# Altium project Full_Bridge_Converter.PrjPcb (part 1 of 2)
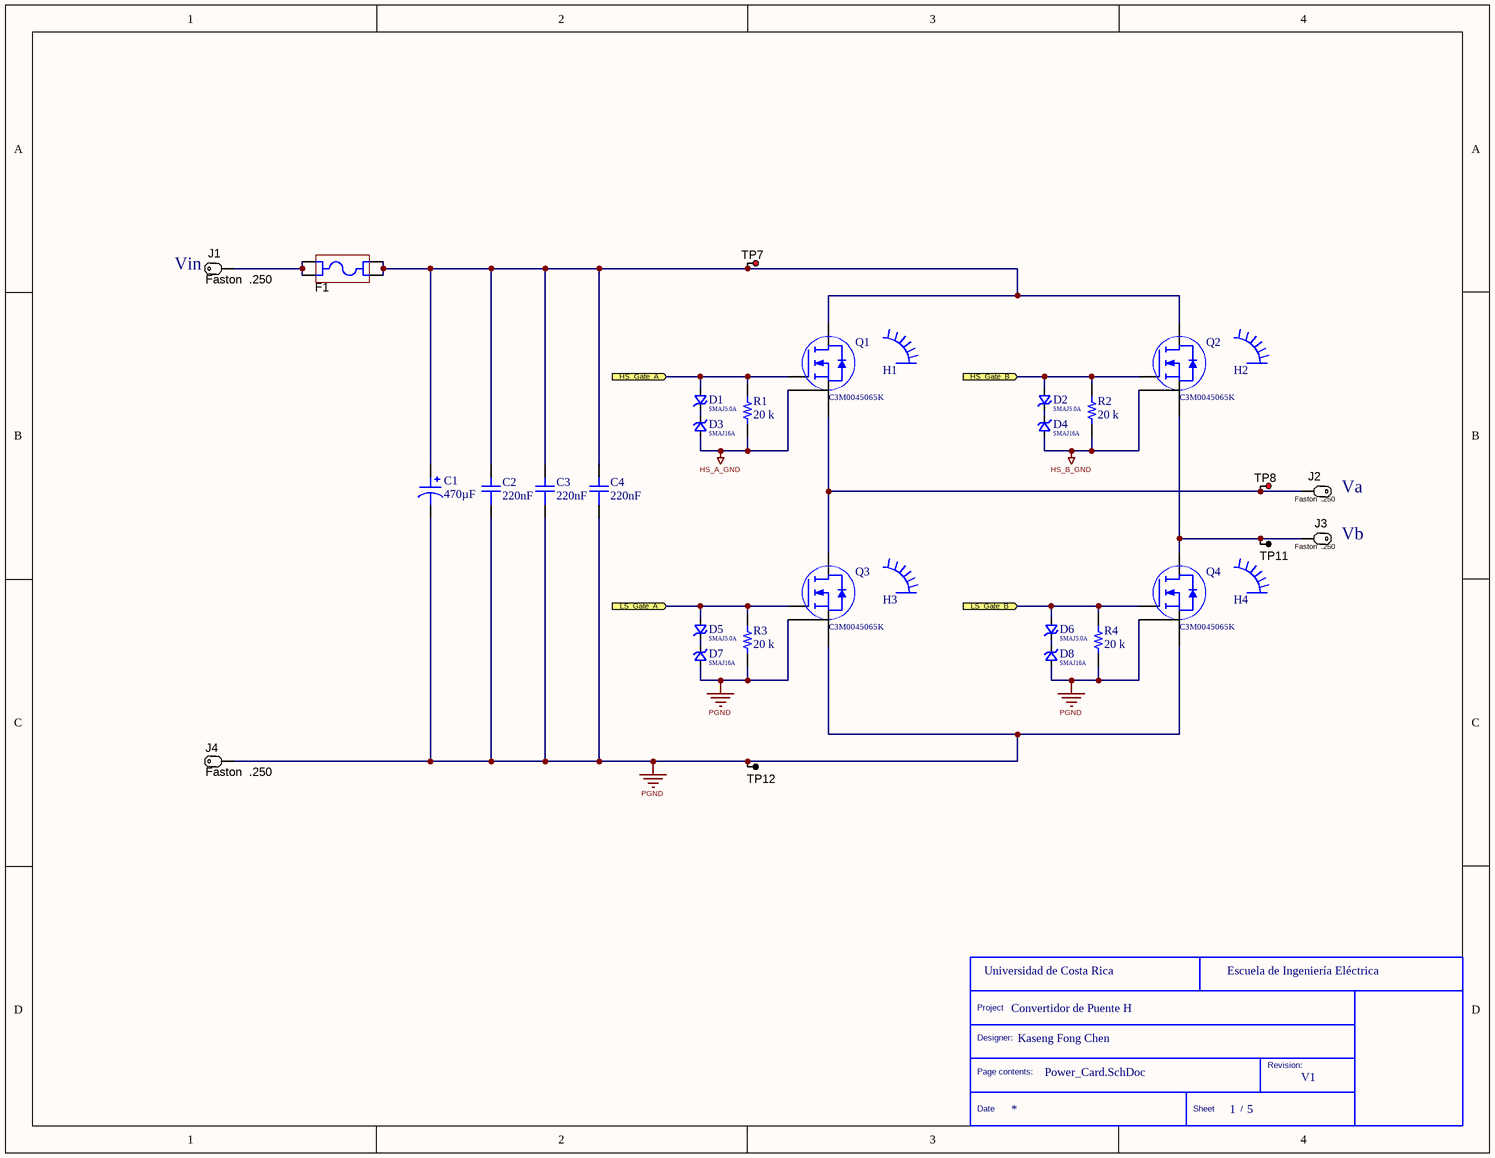
[diagram p0: Power_Card.SchDoc]
Company: Universidad de Costa Rica; Department: Escuela de Ingeniería Eléctrica; DesignByURL: Kaseng Fong Chen; Project: Convertidor de Puente H; VersionRevision: V1
5 sheets, 192 parts. Net scope: flat (ports and power ports of the same name join across sheets).
Board file: Full_Bridge_Converter.PcbDoc
Sheets:
  Power_Card.SchDoc
  Gate_Driver.SchDoc
  PowerSupply.SchDoc
  Optic_PWM.SchDoc
  Hardware.SchDoc

## Sheet Power_Card.SchDoc
size Letter; SheetNumber: 1; SheetTotal: 5

### Parts
(Parts that share a designator on the sheet are numbered #1, #2 ... from top to bottom, then left to right.)
*#1  TittleBlock  (value not drawn)  (graphical)
C1  470µF  [CAP TH ALUM ELEC D35.00mm S10.00mm H40.00mm]
C2  220nF  [R75PI32204030J]
C3  220nF  [R75PI32204030J]
C4  220nF  [R75PI32204030J]
D1  SMAJ5.0A  [DO214AC SMA]
D2  SMAJ5.0A  [DO214AC SMA]
D3  SMAJ16A  [DO214AC SMA]
D4  SMAJ16A  [DO214AC SMA]
D5  SMAJ5.0A  [DO214AC SMA]
D6  SMAJ5.0A  [DO214AC SMA]
D7  SMAJ16A  [DO214AC SMA]
D8  SMAJ16A  [DO214AC SMA]
F1  3101.0040  [SCHURTER_3101_0040]  (value not drawn)
H1  Disipador de 3.3.C/W  [HSINK_6399BG]  (value not drawn)
H2  Disipador de 3.3.C/W  [HSINK_6399BG]  (value not drawn)
H3  Disipador de 3.3.C/W  [HSINK_6399BG]  (value not drawn)
H4  Disipador de 3.3.C/W  [HSINK_6399BG]  (value not drawn)
J1  Faston  .250  [TE_62409-1]
J2  Faston  .250  [TE_62409-1]
J3  Faston  .250  [TE_62409-1]
J4  Faston  .250  [TE_62409-1]
Q1  C3M0045065K  [TO-247-4L_C3M0075120K_WFS]
Q2  C3M0045065K  [TO-247-4L_C3M0075120K_WFS]
Q3  C3M0045065K  [TO-247-4L_C3M0075120K_WFS]
Q4  C3M0045065K  [TO-247-4L_C3M0075120K_WFS]
R1  20 k  [RES 0603_1608]
R2  20 k  [RES 0603_1608]
R3  20 k  [RES 0603_1608]
R4  20 k  [RES 0603_1608]
TP7  5010  [Keystone5010]  (value not drawn)
TP8  5010  [Keystone5010]  (value not drawn)
TP11  5011  [Keystone5011]  (value not drawn)
TP12  5011  [Keystone5011]  (value not drawn)

### Ports
HS_Gate_A (in), HS_Gate_B (in), LS_Gate_A (in), LS_Gate_B (in)

### Nets
HS_A_GND: D3.2 Q1.3(S) R1.1
HS_B_GND: D4.2 Q2.3(S) R2.1
PGND: C1.2 C2.2 C3.2 C4.2 D7.2 D8.2 J4.1(P1) Q3.2(Power_Source) Q3.3(S) Q4.2(Power_Source) Q4.3(S) R3.1 R4.1 TP12.1
NetC1_1: C1.1 C2.1 C3.1 C4.1 F1.3 F1.4 Q1.1(D) Q2.1(D) TP7.1
NetD1_1: D1.1 D3.1
NetD1_2: D1.2 Q1.4(G) R1.2 ; port HS_Gate_A
NetD2_1: D2.1 D4.1
NetD2_2: D2.2 Q2.4(G) R2.2 ; port HS_Gate_B
NetD5_1: D5.1 D7.1
NetD5_2: D5.2 Q3.4(G) R3.2 ; port LS_Gate_A
NetD6_1: D6.1 D8.1
NetD6_2: D6.2 Q4.4(G) R4.2 ; port LS_Gate_B
NetF1_1: F1.1 F1.2 J1.1(P1)
NetJ2_1: J2.1(P1) Q1.2(Power_Source) Q3.1(D) TP8.1
NetJ3_1: J3.1(P1) Q2.2(Power_Source) Q4.1(D) TP11.1

### Notes on the sheet
- (near J1) Vin
- (near J2) Va
- Vb
- (in symbol TittleBlock) Project; Designer:; Page contents:; Revision:; Date; Sheet; /

### Library data of the parts
*#1 = TittleBlock: Standard Title block
C1 = ESMQ451VSN471MA40S: CAP ALUM 470UF 20% 450V SNAP; Manufacturer: United Chemi-Con; Lifetime @ Temp.: 2000 Hrs @ 85°C; Polarization: Polar; Ripple Current @ High Frequency: 3.618A @ 50kHz; Ripple Current @ Low Frequency: 2.53A @ 120Hz; Part Number: ESMQ451VSN471MA40S; Applications: General Purpose; Capacitance: 470µF; ComponentLink1Description: Datasheet; ComponentLink1URL: http://www.chemi-con.co.jp/cgi-bin/CAT_DB/SEARCH/cat_db_al.cgi?e=e&j=p&pdfname=smqlug; ComponentLink2Description: DigiKey Link; ComponentLink2URL: http://digikey.com/product-detail/en/united-chemi-con/ESMQ451VSN471MA40S/565-2798-ND/758010; Device Package: Radial, Can - Snap-In; Height - Seated (Max): 1.575" (40.00mm); LastUpdated: 13/9/2020 09:22:08; Lead Spacing: 0.394" (10.00mm); Lifecycle Status: Active; Minimum Order: 1; Mounting Type: Through Hole; Operating Temperature: -25°C ~ 85°C; Package / Case: Radial, Can - Snap-In; Packaging: Bulk; PartId: 26446; Part Status: Active; Price: 5.99; Series: SMQ; Size / Dimension: 1.378" Dia (35.00mm); Supplier 1: DigiKey; Supplier Part Number 1: 565-2798-ND; Tolerance: ±20%; Value: 470µF; Voltage - Rated: 450V
C2-C4 = R75PI32204030J: KEMET         R75PI32204030J            Film Capacitor, AEC-Q200 R75 Series, 0.22 F,  5%, PP (Polypropylene), 630 V; Voltage Rating: 630V; Voltage Rating (AC): 250V; Dissipation Factor: 0.05%; Lead Diameter: 0.8mm; Lead Length: 30mm; Supplier 1: Digi-Key; Supplier Part Number 1: 399-12761-ND; Manufacturer: KEMET; Manufacturer Part Number: R75PI32204030J; RoHS: Yes; Category: Film Capacitors; Stock 1: 488; Pricing 1: 1=0,95000, 10=0,72000, 50=0,59800, 100=0,51490, 500=0,39860, 1000=0,34324, 2500=0,32110, 5000=0,31002 (USD); Mount: Through Hole; Case/Package: Radial; Dielectric Material: PP; Min Operating Temperature: -55°C; Max Operating Temperature: 105°C; Capacitance: 220nF; Tolerance: 5%; Packaging: Bulk; Voltage Rating (DC): 630V; Dielectric: PP; Termination: PC Pins; Voltage: 630V; Length: 0.709inch; Width: 0.394inch; Height: 16mm; Height - Seated (Max): 0.634inch; Lead Pitch: 15mm; Depth: 10mm; REACH SVHC: No SVHC; RoHS Compliant: Yes; ComponentLink1URL: http://www.alliedelec.com/m/d/0659d349de7ca29105b1b70da899f791.pdf?src-supplier=Allied+Electronics; ComponentLink1Description: http://www.alliedelec.com/m/d/0659d349de7ca29105b1b70da899f791.pdf?src-supplier=Allied+Electronics; ComponentLink2URL: http://www.farnell.com/datasheets/2120989.pdf?src-supplier=Farnell; ComponentLink2Description: http://www.farnell.com/datasheets/2120989.pdf?src-supplier=Farnell; ComponentLink3URL: http://www.kemet.com/docfinder?Partnumber=R75PI32204030J&src-supplier=Digi-Key; ComponentLink3Description: http://www.kemet.com/docfinder?Partnumber=R75PI32204030J&src-supplier=Digi-Key; ComponentLink4URL: http://www.farnell.com/datasheets/2068064.pdf?src-supplier=Element14; ComponentLink4Description: http://www.farnell.com/datasheets/2068064.pdf?src-supplier=Element14
D1 D2 D5 D6 = SMAJ5.0A: BOURNS - SMAJ5.0A - TVS Diode, SMAJ Series, Unidirectional, 5 V, 9.2 V, DO-214AC (SMA), 2 Pins; Max Power Dissipation: 400W; Number of Elements: 1; Max Surge Current: 40A; Reverse Breakdown Voltage: 6.4V; Breakdown Voltage: 7V; Reverse Standoff Voltage: 5V; Clamping Voltage: 9.2V; Test Current: 10mA; Peak Pulse Current: 43.5A; Element Configuration: Single; Leakage Current: 800uA; Operating Supply Voltage: 3.5V; Power Line Protection: No; Diode Type: ZENER; ESD Protection: Yes; Supplier 1: Digi-Key; Supplier Part Number 1: SMAJ5.0ABCT-ND; Manufacturer: Bourns; Manufacturer Part Number: SMAJ5.0A; RoHS: Yes; Category: TVS Diodes; Stock 1: 30981; Pricing 1: 1=0,49000, 10=0,34300, 100=0,17320, 500=0,14130, 1000=0,10483, 2000=0,08820 (USD); Mount: Surface Mount; Case/Package: DO-214AC; Number of Pins: 2; Min Operating Temperature: -55°C; Max Operating Temperature: 150°C; Packaging: Tape and Reel; Package Quantity: 1; Series: SMAJ; Polarity: Unidirectional; Direction: Unidirectional; Peak Pulse Power: 400W; Min Breakdown Voltage: 6.4V; Number of Channels: 1; Max Reverse Leakage Current: 800uA; Termination: SMD/SMT; Max Breakdown Voltage: 7V; Number of Unidirectional Channels: 1; Resistor Type: Zener; Length: 4.57mm; Width: 2.92mm; Height: 2.42mm; Radiation Hardening: No; RoHS Compliant: Yes; REACH SVHC: No SVHC; ComponentLink1URL: https://datasheet.ciiva.com/25624/0900766b8112213b-25624680.pdf?src-supplier=RSComponents; ComponentLink1Description: https://datasheet.ciiva.com/25624/0900766b8112213b-25624680.pdf?src-supplier=RSComponents; ComponentLink2URL: https://datasheet.ciiva.com/333/smaj-333521.pdf?src-supplier=Digi-Key; ComponentLink2Description: https://datasheet.ciiva.com/333/smaj-333521.pdf?src-supplier=Digi-Key; ComponentLink3URL: https://datasheet.ciiva.com/333/smaj-333522.pdf?src-supplier=Digi-Key; ComponentLink3Description: https://datasheet.ciiva.com/333/smaj-333522.pdf?src-supplier=Digi-Key; ComponentLink4URL: https://datasheet.ciiva.com/333/smaj-333523.pdf?src-supplier=Digi-Key; ComponentLink4Description: https://datasheet.ciiva.com/333/smaj-333523.pdf?src-supplier=Digi-Key; ComponentLink5URL: https://datasheet.ciiva.com/3021/smaj-3021400.pdf?src-supplier=Avnet; ComponentLink5Description: https://datasheet.ciiva.com/3021/smaj-3021400.pdf?src-supplier=Avnet; ComponentLink6URL: https://datasheet.ciiva.com/30169/smaj-30169929.pdf?src-supplier=Onlinecomponents.com; ComponentLink6Description: https://datasheet.ciiva.com/30169/smaj-30169929.pdf?src-supplier=Onlinecomponents.com; ComponentLink7URL: https://datasheet.ciiva.com/28409/1695388-28409916.pdf?src-supplier=Element14; ComponentLink7Description: https://datasheet.ciiva.com/28409/1695388-28409916.pdf?src-supplier=Element14
D3 D4 D7 D8 = SMAJ16A: TVS DIODE 16VWM 26VC DO214AC; Manufacturer: Bourns; Clamping Voltage: 26V; Peak Pulse Power: 400W; Reverse Standoff Voltage: 16V; Peak Pulse Current: 15.3A; Polarity: Unidirectional; Test Current: 1mA; Min Breakdown Voltage: 17.8V; Max Surge Current: 40A; Breakdown Voltage: 19.7V; Operating Supply Voltage: 3.5V; Number of Channels: 1; Leakage Current: 5uA; Element Configuration: Single; Power Line Protection: No; Diode Type: ZENER; Supplier 1: Digi-Key; Supplier Part Number 1: SMAJ16ABCT-ND; Manufacturer Part Number: SMAJ16A; RoHS: Yes; Category: TVS Diodes; Stock 1: 14121; Pricing 1: 1=0,49000, 10=0,34400, 100=0,17360, 500=0,14160, 1000=0,10505, 2000=0,08838 (USD); Mount: Surface Mount; Case/Package: DO-214AC; Number of Pins: 2; Min Operating Temperature: -55°C; Max Operating Temperature: 150°C; Packaging: Tape and Reel; Package Quantity: 1; Direction: Unidirectional; Reverse Breakdown Voltage: 17.8V; Number of Elements: 1; Termination: SMD/SMT; Max Reverse Leakage Current: 5uA; Number of Unidirectional Channels: 1; Series: SMAJ; Max Power Dissipation: 400W; Resistor Type: Zener; Max Breakdown Voltage: 19.7V; Radiation Hardening: No; RoHS Compliant: Yes; REACH SVHC: No SVHC; ComponentLink1URL: https://datasheet.ciiva.com/3022/smaj-3022194.pdf?src-supplier=Avnet; ComponentLink1Description: https://datasheet.ciiva.com/3022/smaj-3022194.pdf?src-supplier=Avnet; ComponentLink2URL: https://datasheet.ciiva.com/3022/smaj-3022195.pdf?src-supplier=Avnet; ComponentLink2Description: https://datasheet.ciiva.com/3022/smaj-3022195.pdf?src-supplier=Avnet; ComponentLink3URL: https://datasheet.ciiva.com/8031/1695388-8031131.pdf?src-supplier=Element14; ComponentLink3Description: https://datasheet.ciiva.com/8031/1695388-8031131.pdf?src-supplier=Element14; ComponentLink4URL: https://datasheet.ciiva.com/28649/1695388-28649163.pdf?src-supplier=Element14; ComponentLink4Description: https://datasheet.ciiva.com/28649/1695388-28649163.pdf?src-supplier=Element14; ComponentLink5URL: https://datasheet.ciiva.com/333/smaj-333452.pdf?src-supplier=Digi-Key; ComponentLink5Description: https://datasheet.ciiva.com/333/smaj-333452.pdf?src-supplier=Digi-Key; ComponentLink6URL: https://datasheet.ciiva.com/333/smaj-333453.pdf?src-supplier=Digi-Key; ComponentLink6Description: https://datasheet.ciiva.com/333/smaj-333453.pdf?src-supplier=Digi-Key; ComponentLink7URL: https://datasheet.ciiva.com/17413/smaj-17413677.pdf?src-supplier=Avnet+Europe; ComponentLink7Description: https://datasheet.ciiva.com/17413/smaj-17413677.pdf?src-supplier=Avnet+Europe; ComponentLink8URL: https://datasheet.ciiva.com/333/smaj-333454.pdf?src-supplier=Digi-Key; ComponentLink8Description: https://datasheet.ciiva.com/333/smaj-333454.pdf?src-supplier=Digi-Key; ComponentLink9URL: https://datasheet.ciiva.com/16237/smaj-16237406.pdf?src-supplier=Onlinecomponents.com; ComponentLink9Description: https://datasheet.ciiva.com/16237/smaj-16237406.pdf?src-supplier=Onlinecomponents.com
F1 = 3101.0040: Fuse Holder, 400 V, 16 A, TH; Manufacturer: Schurter; SymbolCreator: a0799628; SymbolVersion: 2014-05-01; CompType: Fuse Holder; PartNumber: 3101.0040; RoHS: Y; PackageReference: Fuse Holder for 5x20mm; MountType: TH; ComponentLink1Description: Datasheet Link; ComponentLink1URL: http://www.schurterinc.com/var/schurter/storage/ilcatalogue/files/document/datasheet/en/pdf/typ_FPG4.pdf; Publisher: Texas Instruments; LatestRevisionDate: 2016-05-10; Supplier 1: Digi-Key; Supplier Part Number 1: 486-1159-ND; Supplier 2: Mouser; Supplier Part Number 2: 693-3101.0040; Supplier 3: Farnell; Supplier Part Number 3: 1222690
H1-H4 = 6399BG: AAVID THERMALLOY         6399BG            Heat Sink, TO-220/218, TO-220, 3.3 C/W, 50 mm, 41.91 mm, 25.4 mm; Finish: Anodized; Natural Thermal Resistance: 3.3°C/W; Supplier 1: Digi-Key; Supplier Part Number 1: HS528-ND; Manufacturer: Aavid Thermalloy; Manufacturer Part Number: 6399BG; RoHS: Yes; Category: Heat Sinks; Stock 1: 1442; Pricing 1: 1=6,20000, 10=6,02800, 25=5,69320, 50=5,35840, 100=5,02350, 250=4,68860, 500=4,35370, 1000=4,26998, 5000=4,18625 (USD); Case/Package: TO-220; Color: Black; Material: Anodized; Type: Passive; Package Quantity: 250; Series: *; Length: 41.91mm; Width: 41.91mm; Height: 50.8mm; Depth: 25.4mm; Radiation Hardening: No; REACH SVHC: No SVHC; Lead Free: Lead Free; RoHS Compliant: Yes; ComponentLink1URL: https://datasheet.ciiva.com/26826/getdatasheetpartid-556672-26826808.pdf?src-supplier=Verical; ComponentLink1Description: https://datasheet.ciiva.com/26826/getdatasheetpartid-556672-26826808.pdf?src-supplier=Verical; ComponentLink2URL: https://datasheet.ciiva.com/16401/aavid20thermalloy206399bg-16401195.pdf?src-supplier=Future+Electronics; ComponentLink2Description: https://datasheet.ciiva.com/16401/aavid20thermalloy206399bg-16401195.pdf?src-supplier=Future+Electronics
J1-J4 = 62409-1: Quick Disconnect Terminal M 15.8mm 7.5mm Tin Over Copper Automotive Bag; Manufacturer: AMP - TE CONNECTIVITY; Supplier 1: Digi-Key; Supplier Part Number 1: A24742-ND; Manufacturer Part Number: 62409-1; RoHS: No; Stock 1: 8729; Pricing 1: 1=0,19000, 10=0,17800, 25=0,15200, 50=0,13320, 100=0,12360, 250=0,10936, 750=0,09035, 1500=0,08083, 8000=0,06895 (USD); ComponentLink1URL: http://www.farnell.com/datasheets/1650963.pdf?src-supplier=Farnell; ComponentLink1Description: http://www.farnell.com/datasheets/1650963.pdf?src-supplier=Farnell; ComponentLink2URL: http://www.farnell.com/datasheets/1650963.pdf?src-supplier=Element14; ComponentLink2Description: http://www.farnell.com/datasheets/1650963.pdf?src-supplier=Element14; ComponentLink3URL: http://www.farnell.com/datasheets/1650963.pdf?src-supplier=Newark; ComponentLink3Description: http://www.farnell.com/datasheets/1650963.pdf?src-supplier=Newark; ComponentLink4URL: https://www.te.com/commerce/DocumentDelivery/DDEController?Action=srchrtrv&DocNm=62409&DocType=Customer+Drawing&DocLang=English&src-supplier=Digi-Key; ComponentLink4Description: https://www.te.com/commerce/DocumentDelivery/DDEController?Action=srchrtrv&DocNm=62409&DocType=Customer+Drawing&DocLang=English&src-supplier=Digi-Key
Q1-Q4 = C3M0045065K: Sic MOSFET 650V; Manufacturer: Cree Wolfspeed; Supplier 1: Digi-Key; Supplier Part Number 1: 1697-C3M0045065K-ND; Manufacturer Part Number: C3M0045065K; RoHS: No; Stock 1: 444; Pricing 1: 1=10,55000 (USD)
R1-R4 = RC0603FR-0720KL: RES SMD 20K OHM 1% 1/10W 0603; Manufacturer: Yageo; Power (Watts): 0.1W, 1/10W; Resistance: 20 kOhms; Temperature Coefficient: ±100ppm/°C; Part Number: RC0603FR-0720KL; Value: 20 k; ComponentLink1Description: Datasheet; ComponentLink1URL: https://www.yageo.com/upload/media/product/productsearch/datasheet/rchip/PYu-RC_Group_51_RoHS_L_10.pdf; ComponentLink2Description: DigiKey Link; ComponentLink2URL: http://digikey.com/product-detail/en/yageo/RC0603FR-0720KL/311-20.0KHRCT-ND/729987; Composition: Thick Film; Device Package: 0603 (1608 Metric); Features: Moisture Resistant; Height - Seated (Max): 0.022" (0.55mm); LastUpdated: 2/9/2020 01:09:40; Lifecycle Status: Active; Minimum Order: 1; Number of Terminations: 2; Operating Temperature: -55°C ~ 155°C; Package / Case: 0603 (1608 Metric); Packaging: CutTape; PartId: 23954; Part Status: Active; Price: 0.10; Series: RC; Size / Dimension: 0.063" L x 0.031" W (1.60mm x 0.80mm); Supplier 1: DigiKey; Supplier Part Number 1: 311-20.0KHRCT-ND; Supplier Device Package: 0603; Tolerance: ±1%
TP7 TP8 = 5010: Test Point, Multipurpose, Red, TH; Manufacturer: Keystone; CompType: Test Point Loop; ContactFinish: Silver; SymbolVersion: 2008-04-04; PartNumber: 5010; PackageReference: Red Multipurpose Testpoint; RoHS: Y; MountType: TH; ComponentLink1Description: Datasheet URL; ComponentLink1URL: http://www.keyelco.com/userAssets/file/M60-2p60.pdf; Color: Red; Publisher: Texas Instruments; LatestRevisionDate: 2016-02-11; Supplier 1: Digi-Key; Supplier Part Number 1: 36-5010-ND; Supplier 2: Mouser; Supplier Part Number 2: 534-5010
TP11 TP12 = 5011: Test Point, Multipurpose, Black, TH; Manufacturer: Keystone; CompType: Test Point Loop; ContactFinish: Silver; SymbolVersion: 2008-04-04; PartNumber: 5011; PackageReference: Black Multipurpose Testpoint; RoHS: Y; MountType: TH; ComponentLink1Description: Datasheet URL; ComponentLink1URL: http://www.keyelco.com/userAssets/file/M60-2p60.pdf; Color: Black; Publisher: Texas Instruments; LatestRevisionDate: 2016-02-11; Supplier 1: Digi-Key; Supplier Part Number 1: 36-5011-ND; Supplier 2: Mouser; Supplier Part Number 2: 534-5011

## Sheet Gate_Driver.SchDoc
size Letter; SheetNumber: 2; SheetTotal: 5
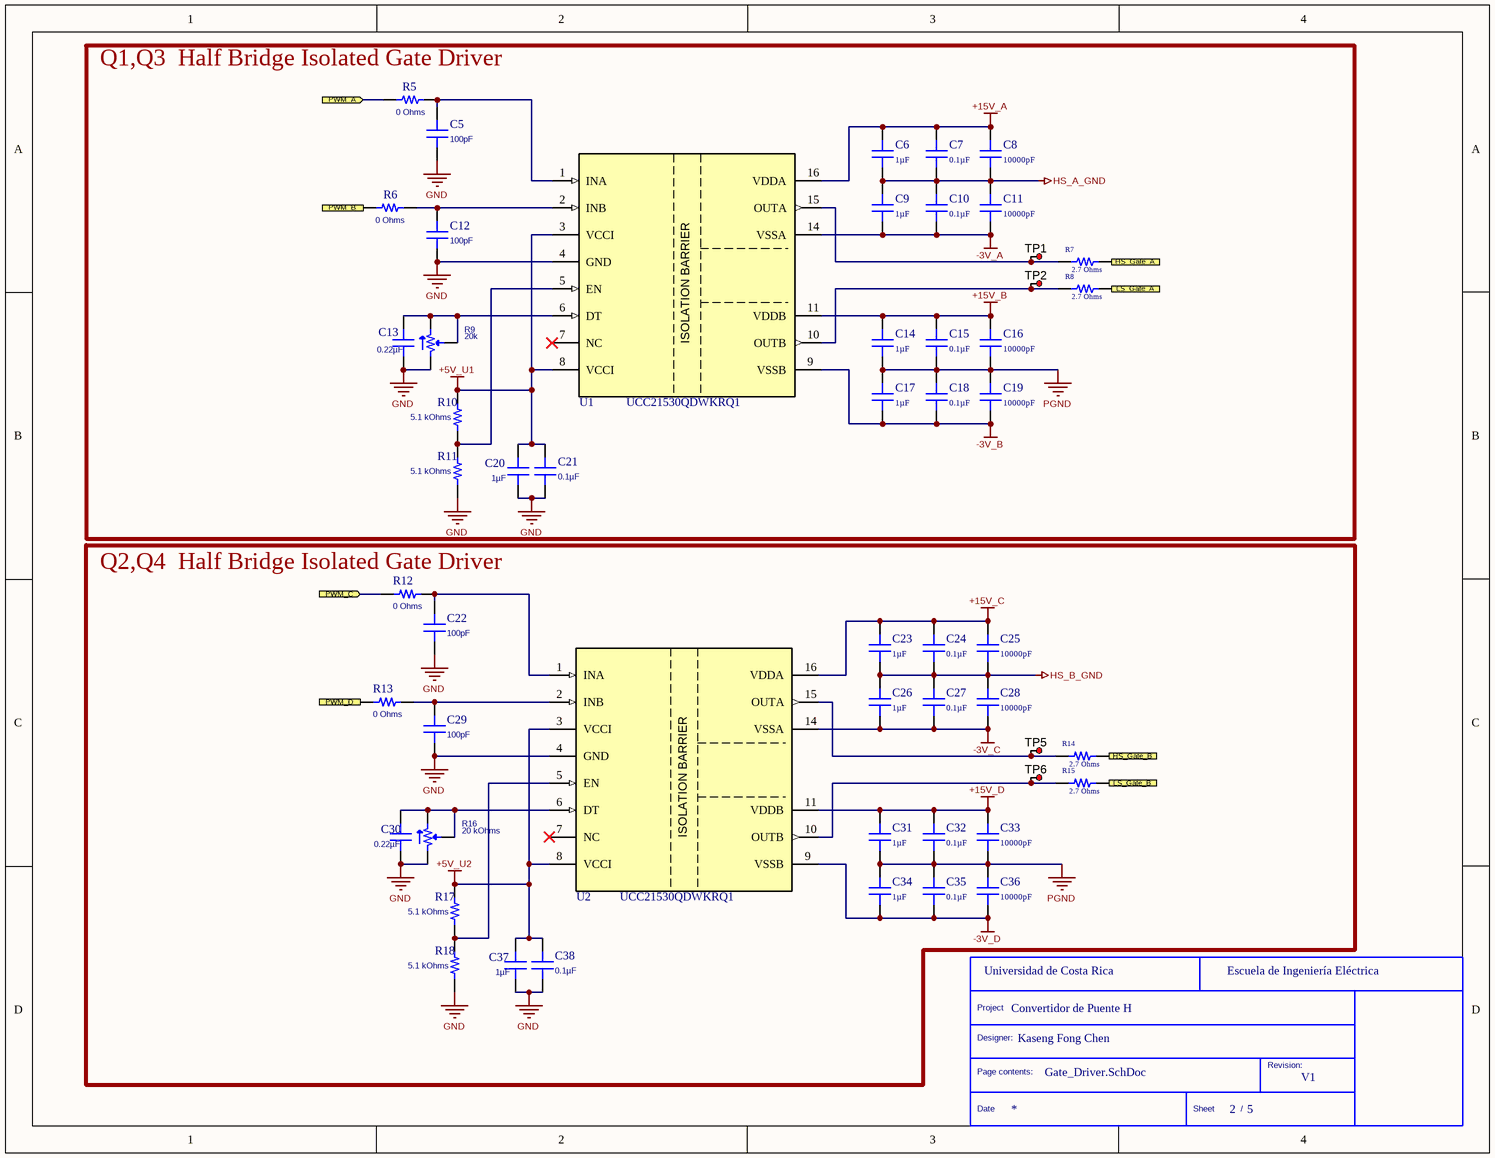
[diagram p1: Gate_Driver.SchDoc]

### Parts
(Parts that share a designator on the sheet are numbered #1, #2 ... from top to bottom, then left to right.)
*#2  TittleBlock  (value not drawn)  (graphical)
C5  100pF  [CAP 0603_1608]
C6  1µF  [CAP 0603_1608]
C7  0.1µF  [CAP 0603_1608]
C8  10000pF  [CAP 0603_1608]
C9  1µF  [CAP 0603_1608]
C10  0.1µF  [CAP 0603_1608]
C11  10000pF  [CAP 0603_1608]
C12  100pF  [CAP 0603_1608]
C13  0.22µF  [CAP 0603_1608]
C14  1µF  [CAP 0603_1608]
C15  0.1µF  [CAP 0603_1608]
C16  10000pF  [CAP 0603_1608]
C17  1µF  [CAP 0603_1608]
C18  0.1µF  [CAP 0603_1608]
C19  10000pF  [CAP 0603_1608]
C20  1µF  [CAP 0603_1608]
C21  0.1µF  [CAP 0603_1608]
C22  100pF  [CAP 0603_1608]
C23  1µF  [CAP 0603_1608]
C24  0.1µF  [CAP 0603_1608]
C25  10000pF  [CAP 0603_1608]
C26  1µF  [CAP 0603_1608]
C27  0.1µF  [CAP 0603_1608]
C28  10000pF  [CAP 0603_1608]
C29  100pF  [CAP 0603_1608]
C30  0.22µF  [CAP 0603_1608]
C31  1µF  [CAP 0603_1608]
C32  0.1µF  [CAP 0603_1608]
C33  10000pF  [CAP 0603_1608]
C34  1µF  [CAP 0603_1608]
C35  0.1µF  [CAP 0603_1608]
C36  10000pF  [CAP 0603_1608]
C37  1µF  [CAP 0603_1608]
C38  0.1µF  [CAP 0603_1608]
R5  0 Ohms  [RES 0603_1608]
R6  0 Ohms  [RES 0603_1608]
R7  2.7 Ohms  [RES 1206_3216]
R8  2.7 Ohms  [RES 1206_3216]
R9  20k  [POT BOURNS TRIMPOT TC33]
R10  5.1 kOhms  [RES 0603_1608]
R11  5.1 kOhms  [RES 0603_1608]
R12  0 Ohms  [RES 0603_1608]
R13  0 Ohms  [RES 0603_1608]
R14  2.7 Ohms  [RES 1206_3216]
R15  2.7 Ohms  [RES 1206_3216]
R16  20 kOhms  [POT BOURNS TRIMPOT TC33]
R17  5.1 kOhms  [RES 0603_1608]
R18  5.1 kOhms  [RES 0603_1608]
TP1  5010  [Keystone5010]  (value not drawn)
TP2  5010  [Keystone5010]  (value not drawn)
TP5  5010  [Keystone5010]  (value not drawn)
TP6  5010  [Keystone5010]  (value not drawn)
U1  UCC21530QDWKRQ1  [DW0016B_HV]
U2  UCC21530QDWKRQ1  [DW0016B_HV]

### Blocks framed on the sheet
Q1,Q3  Half Bridge Isolated Gate Driver: C5-C21 R5-R11 TP1 TP2 U1
Q2,Q4  Half Bridge Isolated Gate Driver: C22-C38 R12-R18 TP5 TP6 U2

### Ports
HS_Gate_A (out), HS_Gate_B (out), LS_Gate_A (out), LS_Gate_B (out), PWM_A (in), PWM_B (in), PWM_C (in), PWM_D (in)

### Nets
+5V_U1: C20.2 C21.2 R10.2 U1.3(VCCI) U1.8(VCCI)
+5V_U2: C37.2 C38.2 R17.2 U2.3(VCCI) U2.8(VCCI)
+15V_A: C6.2 C7.2 C8.2 U1.16(VDDA)
+15V_B: C14.2 C15.2 C16.2 U1.11(VDDB)
+15V_C: C23.2 C24.2 C25.2 U2.16(VDDA)
+15V_D: C31.2 C32.2 C33.2 U2.11(VDDB)
-3V_A: C9.1 C10.1 C11.1 U1.14(VSSA)
-3V_B: C17.1 C18.1 C19.1 U1.9(VSSB)
-3V_C: C26.1 C27.1 C28.1 U2.14(VSSA)
-3V_D: C34.1 C35.1 C36.1 U2.9(VSSB)
GND: C5.1 C12.1 C13.1 C20.1 C21.1 C22.1 C29.1 C30.1 C37.1 C38.1 R9.1 R11.1 R16.1 R18.1 U1.4(GND) U2.4(GND)
HS_A_GND: C6.1 C7.1 C8.1 C9.2 C10.2 C11.2
HS_B_GND: C23.1 C24.1 C25.1 C26.2 C27.2 C28.2
PGND: C14.1 C15.1 C16.1 C17.2 C18.2 C19.2 C31.1 C32.1 C33.1 C34.2 C35.2 C36.2
NetC5_2: C5.2 R5.2 U1.1(INA)
NetC12_2: C12.2 R6.2 U1.2(INB)
NetC13_2: C13.2 R9.2 R9.3 U1.6(DT)
NetC22_2: C22.2 R12.2 U2.1(INA)
NetC29_2: C29.2 R13.2 U2.2(INB)
NetC30_2: C30.2 R16.2 R16.3 U2.6(DT)
NetD1_2: R7.2 ; port HS_Gate_A
NetD2_2: R14.2 ; port HS_Gate_B
NetD5_2: R8.2 ; port LS_Gate_A
NetD6_2: R15.2 ; port LS_Gate_B
NetR5_1: R5.1 ; port PWM_A
NetR6_1: R6.1 ; port PWM_B
NetR7_1: R7.1 TP1.1 U1.15(OUTA)
NetR8_1: R8.1 TP2.1 U1.10(OUTB)
NetR10_1: R10.1 R11.2 U1.5(EN)
NetR12_1: R12.1 ; port PWM_C
NetR13_1: R13.1 ; port PWM_D
NetR14_1: R14.1 TP5.1 U2.15(OUTA)
NetR15_1: R15.1 TP6.1 U2.10(OUTB)
NetR17_1: R17.1 R18.2 U2.5(EN)

Not connected (* = marked no-connect by the designer): U1 7(NC)*; U2 7(NC)*

### Notes on the sheet
- (in symbol TittleBlock) Project; Designer:; Page contents:; Revision:; Date; Sheet; /
- (in symbol UCC21530QDWKRQ1 (2)) ISOLATION BARRIER

### Library data of the parts
*#2 = TittleBlock: Standard Title block
C5 C12 C22 C29 = GCM1885C2A101JA16D: CAP CER 100PF 100V C0G/NP0 0603; Manufacturer: Murata Electronics; Temperature Coefficient: C0G, NP0; Tolerance: ±5%; Part Number: GCM1885C2A101JA16D; Value: 100pF; Applications: Automotive; Capacitance: 100pF; ComponentLink1Description: Datasheet; ComponentLink1URL: https://psearch.en.murata.com/capacitor/product/GCM1885C2A101JA16%23.pdf; ComponentLink2Description: DigiKey Link; ComponentLink2URL: http://digikey.com/product-detail/en/murata-electronics/GCM1885C2A101JA16D/490-4771-1-ND/1641690; Device Package: 0603 (1608 Metric); LastUpdated: 2/9/2020 01:03:33; Lifecycle Status: Active; Minimum Order: 1; Mounting Type: Surface Mount, MLCC; Operating Temperature: -55°C ~ 125°C; Package / Case: 0603 (1608 Metric); Packaging: TapeAndReel; PartId: 3835; Part Status: Active; Price: 0.02; Ratings: AEC-Q200; Series: GCM; Size / Dimension: 0.063" L x 0.031" W (1.60mm x 0.80mm); Supplier 1: DigiKey; Supplier Part Number 1: 490-4771-1-ND; Thickness (Max): 0.035" (0.90mm); Voltage - Rated: 100V
C6 C9 C14 C17 C20 C23 C26 C31 C34 C37 = UMK107AB7105KA-T: CAP CER 1UF 50V X7R 0603; Manufacturer: Taiyo Yuden; Tolerance: ±10%; Part Number: UMK107AB7105KA-T; Value: 1µF; Applications: General Purpose; Capacitance: 1µF; ComponentLink1Description: Datasheet; ComponentLink1URL: https://www.yuden.co.jp/productdata/catalog/mlcc01_e.pdf; ComponentLink2Description: DigiKey Link; ComponentLink2URL: http://digikey.com/product-detail/en/taiyo-yuden/UMK107AB7105KA-T/587-3247-1-ND/3660107; Device Package: 0603 (1608 Metric); LastUpdated: 2/9/2020 01:03:17; Lifecycle Status: Active; Minimum Order: 1; Mounting Type: Surface Mount, MLCC; Operating Temperature: -55°C ~ 125°C; Package / Case: 0603 (1608 Metric); Packaging: TapeAndReel; PartId: 12796; Part Status: Active; Price: 0.05; Series: M; Size / Dimension: 0.063" L x 0.031" W (1.60mm x 0.80mm); Supplier 1: DigiKey; Supplier Part Number 1: 587-3247-1-ND; Temperature Coefficient: X7R; Thickness (Max): 0.037" (0.95mm); Voltage - Rated: 50V
C7 C10 C15 C18 C24 C27 C32 C35 = C0603C104M5RACTU: CAP CER 0.1UF 50V X7R 0603; Manufacturer: KEMET; Tolerance: ±20%; Part Number: C0603C104M5RACTU; Value: 0.1µF; Applications: Bypass, Decoupling; Capacitance: 0.1µF; ComponentLink1Description: Datasheet; ComponentLink1URL: https://api.kemet.com/component-edge/download/datasheet/C0603C104M5RACTU.pdf; ComponentLink2Description: DigiKey Link; ComponentLink2URL: http://digikey.com/product-detail/en/kemet/C0603C104M5RACTU/399-7845-1-ND/3471568; Device Package: 0603 (1608 Metric); LastUpdated: 2/9/2020 01:03:01; Lifecycle Status: Active; Minimum Order: 1; Mounting Type: Surface Mount, MLCC; Operating Temperature: -55°C ~ 125°C; Package / Case: 0603 (1608 Metric); Packaging: TapeAndReel; PartId: 17854; Part Status: Active; Price: 0.01; Series: SMD Comm X7R; Size / Dimension: 0.063" L x 0.031" W (1.60mm x 0.80mm); Supplier 1: DigiKey; Supplier Part Number 1: 399-7845-1-ND; Temperature Coefficient: X7R; Thickness (Max): 0.034" (0.87mm); Voltage - Rated: 50V
C8 C11 C16 C19 C25 C28 C33 C36 = CGA3E2C0G1H103J080AA: CAP CER 10000PF 50V C0G 0603; Manufacturer: TDK Corporation; Temperature Coefficient: C0G, NP0; Tolerance: ±5%; Part Number: CGA3E2C0G1H103J080AA; Value: 10000pF; Applications: Automotive; Capacitance: 10000pF; ComponentLink1Description: Datasheet; ComponentLink1URL: https://product.tdk.com/info/en/catalog/datasheets/mlcc_automotive_general_en.pdf?ref_disty=digikey; ComponentLink2Description: DigiKey Link; ComponentLink2URL: http://digikey.com/product-detail/en/tdk-corporation/CGA3E2C0G1H103J080AA/445-6916-1-ND/2672934; Device Package: 0603 (1608 Metric); LastUpdated: 2/9/2020 01:03:33; Lifecycle Status: Active; Minimum Order: 1; Mounting Type: Surface Mount, MLCC; Operating Temperature: -55°C ~ 125°C; Package / Case: 0603 (1608 Metric); Packaging: TapeAndReel; PartId: 4079; Part Status: Active; Price: 0.06; Ratings: AEC-Q200; Series: CGA; Size / Dimension: 0.063" L x 0.031" W (1.60mm x 0.80mm); Supplier 1: DigiKey; Supplier Part Number 1: 445-6916-1-ND; Thickness (Max): 0.035" (0.90mm); Voltage - Rated: 50V
C13 C30 = GRM188R71E224KA88J: CAP CER 0.22UF 25V X7R 0603; Manufacturer: Murata Electronics; Tolerance: ±10%; Part Number: GRM188R71E224KA88J; Value: 0.22µF; Applications: General Purpose; Capacitance: 0.22µF; ComponentLink1Description: Datasheet; ComponentLink1URL: https://www.murata.com/~/media/webrenewal/support/library/catalog/products/capacitor/mlcc/c02e.ashx?la=en-us; ComponentLink2Description: DigiKey Link; ComponentLink2URL: http://digikey.com/product-detail/en/murata-electronics/GRM188R71E224KA88J/490-11522-1-ND/5333362; Device Package: 0603 (1608 Metric); LastUpdated: 2/9/2020 01:03:21; Lifecycle Status: Active; Minimum Order: 1; Mounting Type: Surface Mount, MLCC; Operating Temperature: -55°C ~ 125°C; Package / Case: 0603 (1608 Metric); Packaging: TapeAndReel; PartId: 10549; Part Status: Active; Price: 0.03; Series: GRM; Size / Dimension: 0.063" L x 0.031" W (1.60mm x 0.80mm); Supplier 1: DigiKey; Supplier Part Number 1: 490-11522-1-ND; Temperature Coefficient: X7R; Thickness (Max): 0.035" (0.90mm); Voltage - Rated: 25V
C21 C38 = CGA3E2X7R1E104K080AA: CAP CER 0.1UF 25V X7R 0603; Manufacturer: TDK Corporation; Tolerance: ±10%; Part Number: CGA3E2X7R1E104K080AA; Value: 0.1µF; Applications: Automotive; Capacitance: 0.1µF; ComponentLink1Description: Datasheet; ComponentLink1URL: https://product.tdk.com/info/en/catalog/datasheets/mlcc_automotive_general_en.pdf?ref_disty=digikey; ComponentLink2Description: DigiKey Link; ComponentLink2URL: http://digikey.com/product-detail/en/tdk-corporation/CGA3E2X7R1E104K080AA/445-5667-1-ND/2443707; Device Package: 0603 (1608 Metric); LastUpdated: 2/9/2020 01:03:30; Lifecycle Status: Active; Minimum Order: 1; Mounting Type: Surface Mount, MLCC; Operating Temperature: -55°C ~ 125°C; Package / Case: 0603 (1608 Metric); Packaging: TapeAndReel; PartId: 5534; Part Status: Active; Price: 0.01; Ratings: AEC-Q200; Series: CGA; Size / Dimension: 0.063" L x 0.031" W (1.60mm x 0.80mm); Supplier 1: DigiKey; Supplier Part Number 1: 445-5667-1-ND; Temperature Coefficient: X7R; Thickness (Max): 0.035" (0.90mm); Voltage - Rated: 25V
R5 R6 R12 R13 = CRCW06030000Z0EAHP: RES SMD 0 OHM JUMPER 1/4W 0603; Manufacturer: Vishay Dale; Power (Watts): 0.25W, 1/4W; Part Number: CRCW06030000Z0EAHP; Value: 0 Ohms; ComponentLink1Description: Datasheet; ComponentLink1URL: http://www.vishay.com/docs/20043/crcwhpe3.pdf; ComponentLink2Description: DigiKey Link; ComponentLink2URL: http://digikey.com/product-detail/en/vishay-dale/CRCW06030000Z0EAHP/541-0.0SBCT-ND/2222749; Composition: Thick Film; Device Package: 0603 (1608 Metric); Features: Automotive AEC-Q200, Pulse Withstanding; Height - Seated (Max): 0.022" (0.55mm); LastUpdated: 2/9/2020 01:10:23; Lifecycle Status: Active; Minimum Order: 1; Number of Terminations: 2; Operating Temperature: -55°C ~ 155°C; Package / Case: 0603 (1608 Metric); Packaging: TapeAndReel; PartId: 5474; Part Status: Active; Price: 0.02; Ratings: AEC-Q200; Resistance: 0 Ohms; Series: CRCW-HP; Size / Dimension: 0.063" L x 0.033" W (1.60mm x 0.85mm); Supplier 1: DigiKey; Supplier Part Number 1: 541-0.0SBCT-ND; Supplier Device Package: 0603; Tolerance: Jumper
R7 R8 R14 R15 = CRCW12062R70FKEAHP: RES SMD 2.7 OHM 1% 3/4W 1206; Manufacturer: Vishay Dale; Power (Watts): 0.75W, 3/4W; Temperature Coefficient: ±100ppm/°C; Part Number: CRCW12062R70FKEAHP; ComponentLink1Description: Datasheet; ComponentLink1URL: http://www.vishay.com/docs/20043/crcwhpe3.pdf; ComponentLink2Description: DigiKey Link; ComponentLink2URL: http://digikey.com/product-detail/en/vishay-dale/CRCW12062R70FKEAHP/541-2.70UCT-ND/5326978; Composition: Thick Film; Device Package: 1206 (3216 Metric); Features: Automotive AEC-Q200, Pulse Withstanding; Height - Seated (Max): 0.024" (0.60mm); LastUpdated: 2/9/2020 01:12:48; Lifecycle Status: Active; Minimum Order: 1; Number of Terminations: 2; Operating Temperature: -55°C ~ 155°C; Package / Case: 1206 (3216 Metric); Packaging: TapeAndReel; PartId: 36112; Part Status: Active; Price: 0.06; Ratings: AEC-Q200; Resistance: 2.7 Ohms; Series: CRCW-HP; Size / Dimension: 0.122" L x 0.063" W (3.10mm x 1.60mm); Supplier 1: DigiKey; Supplier Part Number 1: 541-2.70UCT-ND; Supplier Device Package: 1206; Tolerance: ±1%; Value: 2.7 Ohms
R9 = TC33X-2-203E: TRIMMER 20K OHM 0.1W J LEAD TOP; Manufacturer: Bourns Inc.; Adjustment Type: Top Adjustment; Number of Turns: 1; Power (Watts): 0.1W, 1/10W; Resistance: 20 kOhms; Resistive Material: Cermet; Temperature Coefficient: ±250ppm/°C; Tolerance: ±25%; Part Number: TC33X-2-203E; ComponentLink1Description: Datasheet; ComponentLink1URL: https://www.bourns.com/docs/Product-Datasheets/TC33.pdf; ComponentLink2Description: DigiKey Link; ComponentLink2URL: http://digikey.com/product-detail/en/bourns-inc/TC33X-2-203E/TC33X-2-203ECT-ND/3437930; LastUpdated: 2/9/2020 01:21:42; Lifecycle Status: Active; Minimum Order: 1; Mounting Type: Surface Mount; Packaging: TapeAndReel; PartId: 12; Part Status: Active; Price: 0.15; Series: Trimpot® TC33 - Open Frame; Size / Dimension: Rectangular - 0.150" x 0.142" Face x 0.047" H (3.80mm x 3.60mm x 1.20mm); Supplier 1: DigiKey; Supplier Part Number 1: TC33X-2-203ECT-ND; Termination Style: J Lead; Value: 20k
R10 R11 R17 R18 = RC0603JR-075K1L: RES SMD 5.1K OHM 5% 1/10W 0603; Manufacturer: Yageo; Power (Watts): 0.1W, 1/10W; Temperature Coefficient: ±100ppm/°C; Part Number: RC0603JR-075K1L; Value: 5.1 kOhms; ComponentLink1Description: Datasheet; ComponentLink1URL: https://www.yageo.com/upload/media/product/productsearch/datasheet/rchip/PYu-RC_Group_51_RoHS_L_10.pdf; ComponentLink2Description: DigiKey Link; ComponentLink2URL: http://digikey.com/product-detail/en/yageo/RC0603JR-075K1L/311-5.1KGRCT-ND/729743; Composition: Thick Film; Device Package: 0603 (1608 Metric); Features: Moisture Resistant; Height - Seated (Max): 0.022" (0.55mm); LastUpdated: 2/9/2020 01:09:58; Lifecycle Status: Active; Minimum Order: 1; Number of Terminations: 2; Operating Temperature: -55°C ~ 155°C; Package / Case: 0603 (1608 Metric); Packaging: CutTape; PartId: 17113; Part Status: Active; Price: 0.10; Resistance: 5.1 kOhms; Series: RC; Size / Dimension: 0.063" L x 0.031" W (1.60mm x 0.80mm); Supplier 1: DigiKey; Supplier Part Number 1: 311-5.1KGRCT-ND; Supplier Device Package: 0603; Tolerance: ±5%
R16 = TC33X-2-203E: TRIMMER 20K OHM 0.1W J LEAD TOP; Manufacturer: Bourns Inc.; Adjustment Type: Top Adjustment; Number of Turns: 1; Power (Watts): 0.1W, 1/10W; Resistive Material: Cermet; Temperature Coefficient: ±250ppm/°C; Tolerance: ±25%; Part Number: TC33X-2-203E; ComponentLink1Description: Datasheet; ComponentLink1URL: https://www.bourns.com/docs/Product-Datasheets/TC33.pdf; ComponentLink2Description: DigiKey Link; ComponentLink2URL: http://digikey.com/product-detail/en/bourns-inc/TC33X-2-203E/TC33X-2-203ECT-ND/3437930; LastUpdated: 2/9/2020 01:21:42; Lifecycle Status: Active; Minimum Order: 1; Mounting Type: Surface Mount; Packaging: TapeAndReel; PartId: 12; Part Status: Active; Price: 0.15; Resistance: 20 kOhms; Series: Trimpot® TC33 - Open Frame; Size / Dimension: Rectangular - 0.150" x 0.142" Face x 0.047" H (3.80mm x 3.60mm x 1.20mm); Supplier 1: DigiKey; Supplier Part Number 1: TC33X-2-203ECT-ND; Termination Style: J Lead; Value: 20 kOhms
TP1 TP2 TP5 TP6 = 5010: as TP7 on sheet Power_Card; SymbolVersion: 2008-04-04; PartNumber: 5010; PackageReference: Red Multipurpose Testpoint; RoHS: Y; MountType: TH; ComponentLink1Description: Datasheet URL; ComponentLink1URL: http://www.keyelco.com/userAssets/file/M60-2p60.pdf; Color: Red; Publisher: Texas Instruments; LatestRevisionDate: 2016-02-11; Supplier 1: Digi-Key; Supplier Part Number 1: 36-5010-ND; Supplier 2: Mouser; Supplier Part Number 2: 534-5010
U1 U2 = UCC21530QDWKRQ1 (2): Isolated Dual-Channel Gate Driver 6A 2-Output High Side/Low Side/Half-Bridge 14-Pin SOIC T/R; Manufacturer: Texas Instruments; Supplier 1: Mouser; Supplier Part Number 1: 595-UCC21530QDWKRQ1; Manufacturer Part Number: UCC21530QDWKRQ1; RoHS: Yes; Category: Integrated Circuits (ICs); Stock 1: 1426; Pricing 1: 1=5,17000, 10=4,64000, 50=4,39000, 100=3,61000, 1000=2,59000, 10000=2,50000 (USD); RoHS Compliant: Yes